# Altium schematic sheet VESC_KS75600_power.SchDoc
size A3; SheetNumber: 2; SheetTotal: 4
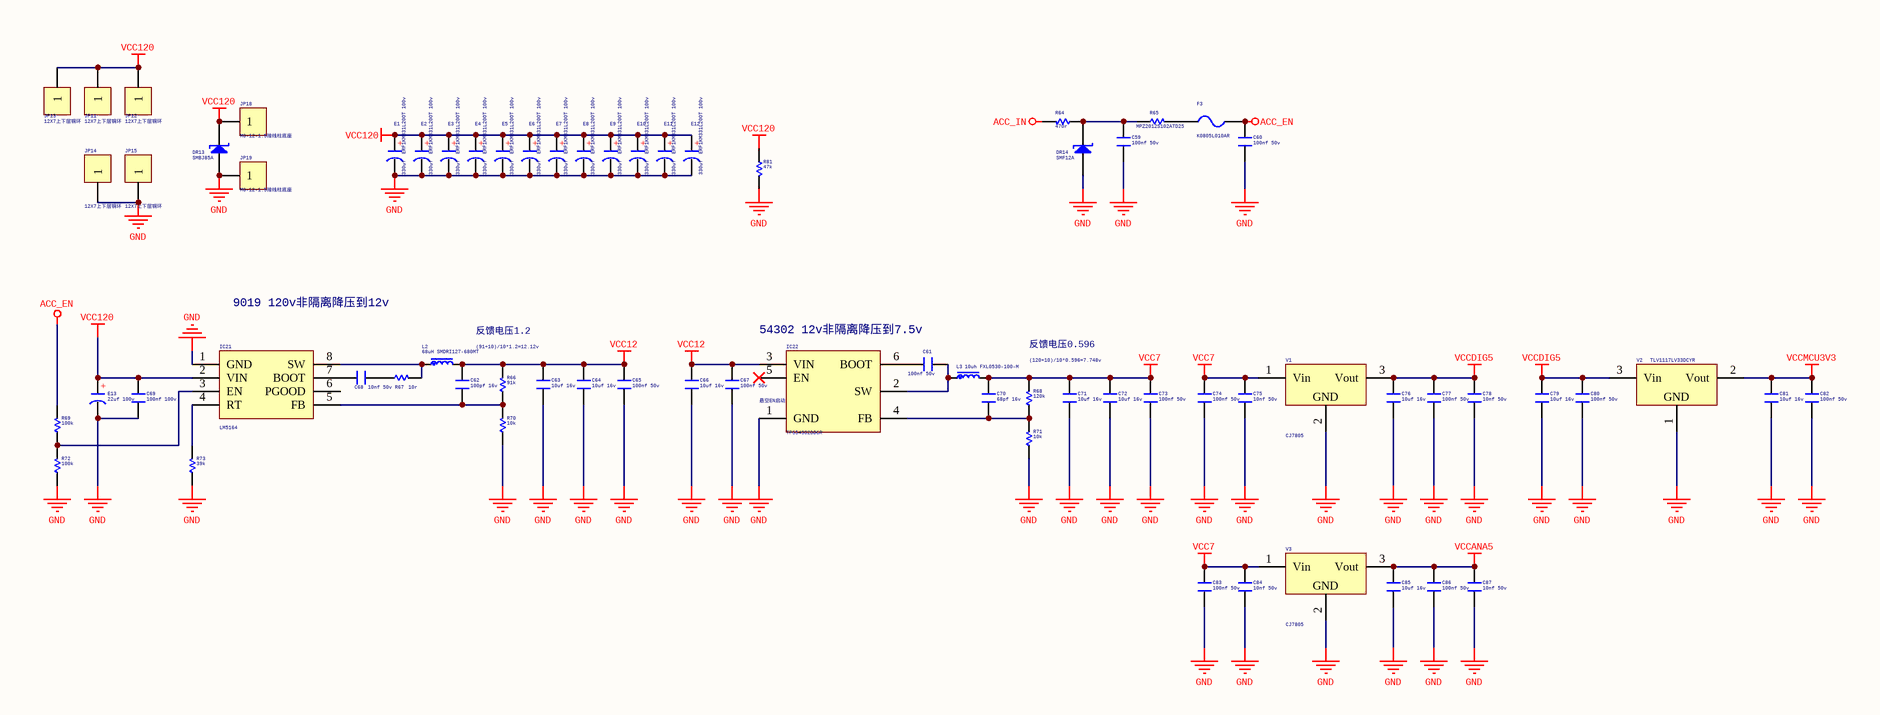
[diagram p0: VESC_KS75600_power.SchDoc]

## Parts
C59  100nf 50v  [C 0805]
C60  100nf 50v  [C 0805]
C61  100nf 50v  [C 0805]
C62  100pf 16v  [C 0603]
C63  10uf 16v  [C 0805]
C64  10uf 16v  [C 0805]
C65  100nf 50v  [C 0805]
C66  10uf 16v  [C 0805]
C67  100nf 50v  [C 0805]
C68  10nf 50v  [C 0603]
C69  100nf 100v  [C 1206]
C70  68pf 16v  [C 0603]
C71  10uf 16v  [C 0805]
C72  10uf 16v  [C 0805]
C73  100nf 50v  [C 0805]
C74  100nf 50v  [C 0603]
C75  10nf 50v  [C 0603]
C76  10uf 16v  [C 0805]
C77  100nf 50v  [C 0603]
C78  10nf 50v  [C 0603]
C79  10uf 16v  [C 0805]
C80  100nf 50v  [C 0603]
C81  10uf 16v  [C 0805]
C82  100nf 50v  [C 0603]
C83  100nf 50v  [C 0603]
C84  10nf 50v  [C 0603]
C85  10uf 16v  [C 0805]
C86  100nf 50v  [C 0603]
C87  10nf 50v  [C 0603]
DR13  SMBJ85A  [SMB]
DR14  SMF12A  [SOD-123F]
E1  330uf  ERF1KM331L20OT 100v  [CAP 7.5*16*25 - GD]
E2  330uf  ERF1KM331L20OT 100v  [CAP 7.5*16*25 - GD]
E3  330uf  ERF1KM331L20OT 100v  [CAP 7.5*16*25 - GD]
E4  330uf  ERF1KM331L20OT 100v  [CAP 7.5*16*25 - GD]
E5  330uf  ERF1KM331L20OT 100v  [CAP 7.5*16*25 - GD]
E6  330uf  ERF1KM331L20OT 100v  [CAP 7.5*16*25 - GD]
E7  330uf  ERF1KM331L20OT 100v  [CAP 7.5*16*25 - GD]
E8  330uf  ERF1KM331L20OT 100v  [CAP 7.5*16*25 - GD]
E9  330uf  ERF1KM331L20OT 100v  [CAP 7.5*16*25 - GD]
E10  330uf  ERF1KM331L20OT 100v  [CAP 7.5*16*25 - GD]
E11  330uf  ERF1KM331L20OT 100v  [CAP 7.5*16*25 - GD]
E12  330uf  ERF1KM331L20OT 100v  [CAP 7.5*16*25 - GD]
E13  22uf 100v  [CAP 2.5*6.3*11.2 - BK]
F3  K0805L010AR  [FU 0805]
IC21  LM5164  [SOP8_EPAD_L]
IC22  TPS54302DDCR  [SOT23-6L]
JP11  12X7上下层铜环  [11x6.5上下层铜环]
JP12  12X7上下层铜环  [11x6.5上下层铜环]
JP13  12X7上下层铜环  [11x6.5上下层铜环]
JP14  12X7上下层铜环  [11x6.5上下层铜环]
JP15  12X7上下层铜环  [11x6.5上下层铜环]
JP18  M6-12-1.5接线柱底座  [接线柱底座焊盘]
JP19  M6-12-1.5接线柱底座  [接线柱底座焊盘]
L2  68uH SMDRI127-680MT  [CDRH127]
L3  10uh FXL0530-100-M  [L-SMD-0530]
R64  470r  [R 1206]
R65  MPZ2012S102ATD25  [R 0805]
R66  91k  [R 0603]
R67  10r  [R 1206-HP]
R68  120k  [R 0603]
R69  100k  [R 0805]
R70  10k  [R 0603]
R71  10k  [R 0603]
R72  100k  [R 0805]
R73  39k  [R 0805]
R81  47k  [R 2512]
V1  CJ7805  [TO252]
V2  TLV1117LV33DCYR  [SOT223_L]
V3  CJ7805  [TO252]

## Nets
ACC_EN: C60.1 F3.1 R69.2
ACC_IN: R64.2
GND: C59.2 C60.2 C63.2 C64.2 C65.2 C66.2 C67.2 C69.1 C71.2 C72.2 C73.2 C74.2 C75.2 C76.1 C77.2 C78.2 C79.2 C80.2 C81.2 C82.2 C83.2 C84.2 C85.1 C86.2 C87.2 DR13.1(A) DR14.1(A) E1.2 E2.2 E3.2 E4.2 E5.2 E6.2 E7.2 E8.2 E9.2 E10.2 E11.2 E12.2 E13.2 IC21.1(GND) IC22.1(GND) JP14.1 JP15.1 JP19.1 R70.1 R71.1 R72.1 R73.1 R81.2 V1.2(GND) V2.1(GND) V3.2(GND)
VCC7: C70.1 C71.1 C72.1 C73.1 C74.1 C75.1 C83.1 C84.1 L3.2 R68.2 V1.1(Vin) V3.1(Vin)
VCC12: C62.1 C63.1 C64.1 C65.1 C66.1 C67.1 IC22.3(VIN) L2.2 R66.2
VCC120: C69.2 DR13.2(K) E1.1 E2.1 E3.1 E4.1 E5.1 E6.1 E7.1 E8.1 E9.1 E10.1 E11.1 E12.1 E13.1 IC21.2(VIN) JP11.1 JP12.1 JP13.1 JP18.1 R81.1
VCCANA5: C85.2 C86.1 C87.1 V3.3(Vout)
VCCDIG5: C76.2 C77.1 C78.1 C79.1 C80.1 V1.3(Vout) V2.3(Vin)
VCCMCU3V3: C81.1 C82.1 V2.2(Vout)
NetC59_1: C59.1 DR14.2(K) R64.1 R65.1
NetC61_1: C61.1 IC22.6(BOOT)
NetC61_2: C61.2 IC22.2(SW) L3.1
NetC62_2: C62.2 IC21.5(FB) R66.1 R70.2
NetC68_1: C68.1 R67.1
NetC68_2: C68.2 IC21.7(BOOT)
NetC70_2: C70.2 IC22.4(FB) R68.1 R71.2
NetF3_2: F3.2 R65.2
NetIC21_3: IC21.3(EN) R69.1 R72.2
NetIC21_4: IC21.4(RT) R73.2
NetIC21_8: IC21.8(SW) L2.1 R67.2

Not connected (* = marked no-connect by the designer): IC21 6(PGOOD); IC22 5(EN)*

## Notes on the sheet
- 9019 120v非隔离降压到12v
- (91+10)/10*1.2=12.12v
- 反馈电压1.2
- (near IC22) 54302 12v非隔离降压到7.5v
- (120+10)/10*0.596=7.748v
- 反馈电压0.596
- (near IC22) 悬空EN启动
- (in symbol C-CAP) +

## Library data of the parts
C59-C87 = C: 无极性贴片电容
  C59-C61 C65 C67 C73 C74 C77 C80 C82 C83 C86: Voltage: 50v; Value: 100nf
  C62: Voltage: 16v; Value: 100pf
  C63 C64 C66 C71 C72 C76 C79 C81 C85: Voltage: 16v; Value: 10uf
  C68 C75 C78 C84 C87: Voltage: 50v; Value: 10nf
  C69: Voltage: 100v; Value: 100nf
  C70: Voltage: 16v; Value: 68pf
DR13 DR14 = DR_S: 瞬态电压抑制二极管(单向)
E1-E13 = C-CAP: 直插电解电容; Voltage: 100v
  E1-E12: Value: 330uf  ERF1KM331L20OT
  E13: Value: 22uf
F3 = FU: 贴片保险丝
IC21 = MK9019: 100V 1Mhz BUCK控制器
IC22 = TPS54302: 4.5V 至 28V 输入、3A 输出、EMI 友好型同步降压转换器
JP11-JP15 JP18 JP19 = Header 1: 1P接插件
L2 = L-CDRH: 功率屏蔽电感; Value: 68uH SMDRI127-680MT
L3 = L-SMD: 贴片一体成形功率电感; Value: 10uh FXL0530-100-M
R64-R73 R81 = R: 贴片电阻
  R64: Value: 470r
  R65: Value: MPZ2012S102ATD25
  R66: Value: 91k
  R67: Value: 10r
  R68: Value: 120k
  R69 R72: Value: 100k
  R70 R71: Value: 10k
  R73: Value: 39k
  R81: Value: 47k
V1 V3 = 78xx: 线性稳压芯片
V2 = AMS1117: 三端稳压芯片